# EAGLE design miniUPS (EAGLE 9.6.0)
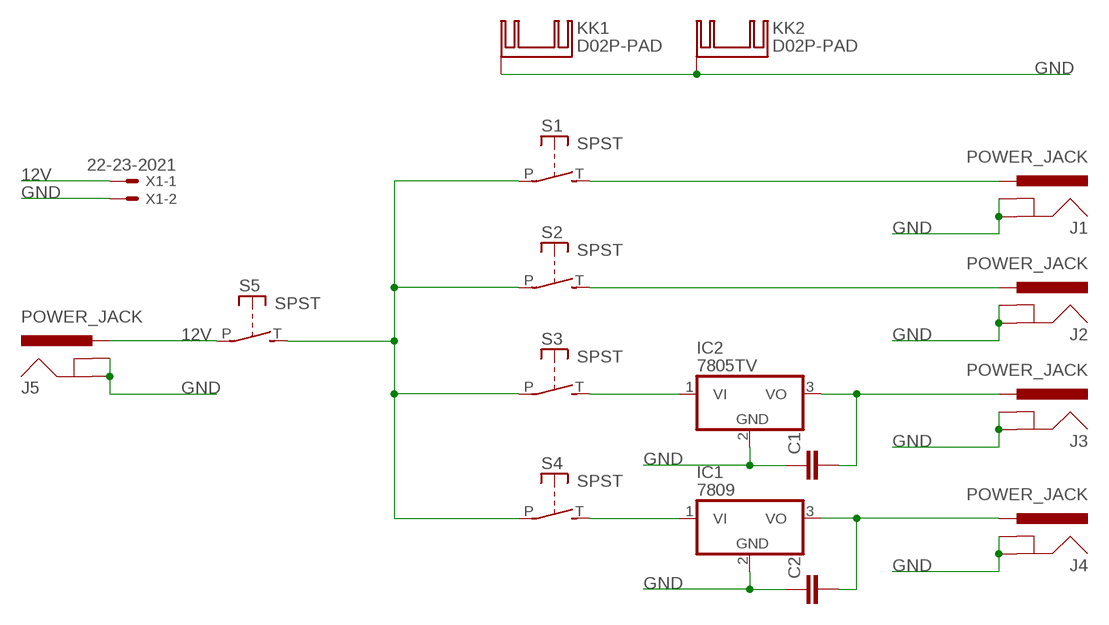
[diagram p0: schematic, sheet 1]

## Parts
C1  CAPPTH2  [CAP-PTH-SMALL2]
C2  CAPPTH2  [CAP-PTH-SMALL2]
IC1  7809  7805TV  [TO220V]
IC2  7805TV  [TO220V]
J1  POWER_JACK  [POWER_JACK_PTH]
J2  POWER_JACK  [POWER_JACK_PTH]
J3  POWER_JACK  [POWER_JACK_PTH]
J4  POWER_JACK  [POWER_JACK_PTH]
J5  POWER_JACK  [POWER_JACK_PTH]
KK1  D02P-PAD  [D02PA-PAD]
KK2  D02P-PAD  [D02PA-PAD]
S1  SPST  [JUDCOSPST]
S2  SPST  [JUDCOSPST]
S3  SPST  [JUDCOSPST]
S4  SPST  [JUDCOSPST]
S5  SPST  [JUDCOSPST]
X1  22-23-2021  [22-23-2021]

## Nets
12V: J5.PWR S5.P X1.1
GND: C1.1 C2.1 IC1.2(GND) IC2.2(GND) J1.GND J1.GNDBREAK J2.GND J2.GNDBREAK J3.GND J3.GNDBREAK J4.GND J4.GNDBREAK J5.GND J5.GNDBREAK KK1.B(K) KK2.B(K) X1.2
N$1: J1.PWR S1.T(S)
N$2: J2.PWR S2.T(S)
N$3: C1.2 IC2.3(VO) J3.PWR
N$4: C2.2 IC1.3(VO) J4.PWR
N$5: IC2.1(VI) S3.T(S)
N$8: IC1.1(VI) S4.T(S)
N$9: S1.P S2.P S3.P S4.P S5.T(S)

## Library data of the parts
C1 C2 = 1X08_OFFSET_75_PERCENT:CAP: Capacitor Standard 0603 ceramic capacitor, and 0.1" leaded capacitor.
IC1 IC2 = linear:78*: Positive VOLTAGE REGULATOR Source: http://cache.national.com/ds/LM/LM78L05.pdf http://www.fairchildsemi.com/ds/LM/LM7805.pdf
J1-J5 = SparkFun-Connectors:POWER_JACK: Power Jack Connector This is the standard 5.5mm barrel jack for power. The PTH is the most common, proven, reliable, footprint. The Slot footprint only works if the mill layer is transmitted to the PCB fab house so be warned. Here are the connectors we sell at SparkFun: DC Barrel Power Jack/Connector <https://www.sparkfun.com/products/119> (PRT-00119) DC Barrel Power Jack/Connector (SMD) <https://www.sparkfun.com/products/12748> (PRT-12748) DC Barrel Jack Adapter - Breadboard Compatible <https://www.sparkfun.com/products/10811> (PRT-10811) It is used on this SparkFun product (and many, many others): SparkFun RedBoard - Programmed with Arduino <https://www.sparkfun.com/products/12757> (DEV-12757) Also, if you need a mating power supply or connector, please check these out: Wall Adapter Power Supply - 9VDC 650mA <https://www.sparkfun.com/products/298> (TOL-00298) DC Barrel Jack Adapter - Male <https://www.sparkfun.com/products/10287> (PRT-10287); PROD_ID: CONN-08197
KK1 KK2 = heatsink:D02P-PAD: HEATSINK distributor Schukat
S1-S5 = adafruit:SPST: Judco 50-0015-00
X1 = con-molex:22-23-2021: .100" (2.54mm) Center Header - 2 Pin; MF: MOLEX; MPN: 22-23-2021; OC_FARNELL: 1462926; OC_NEWARK: 25C3832

## Board
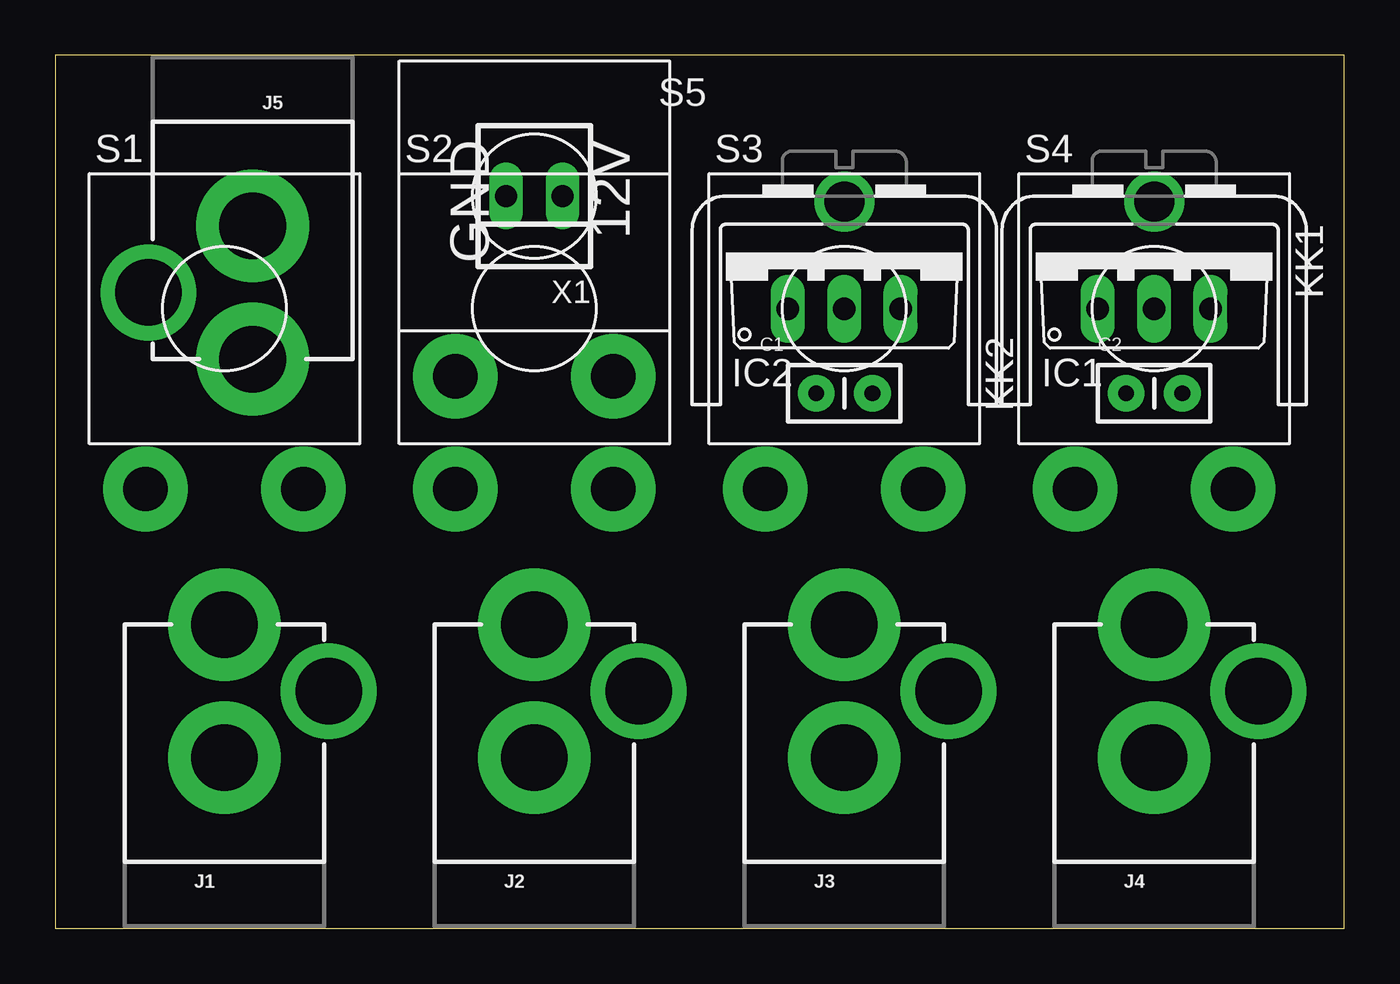
[diagram p1: board, top side]
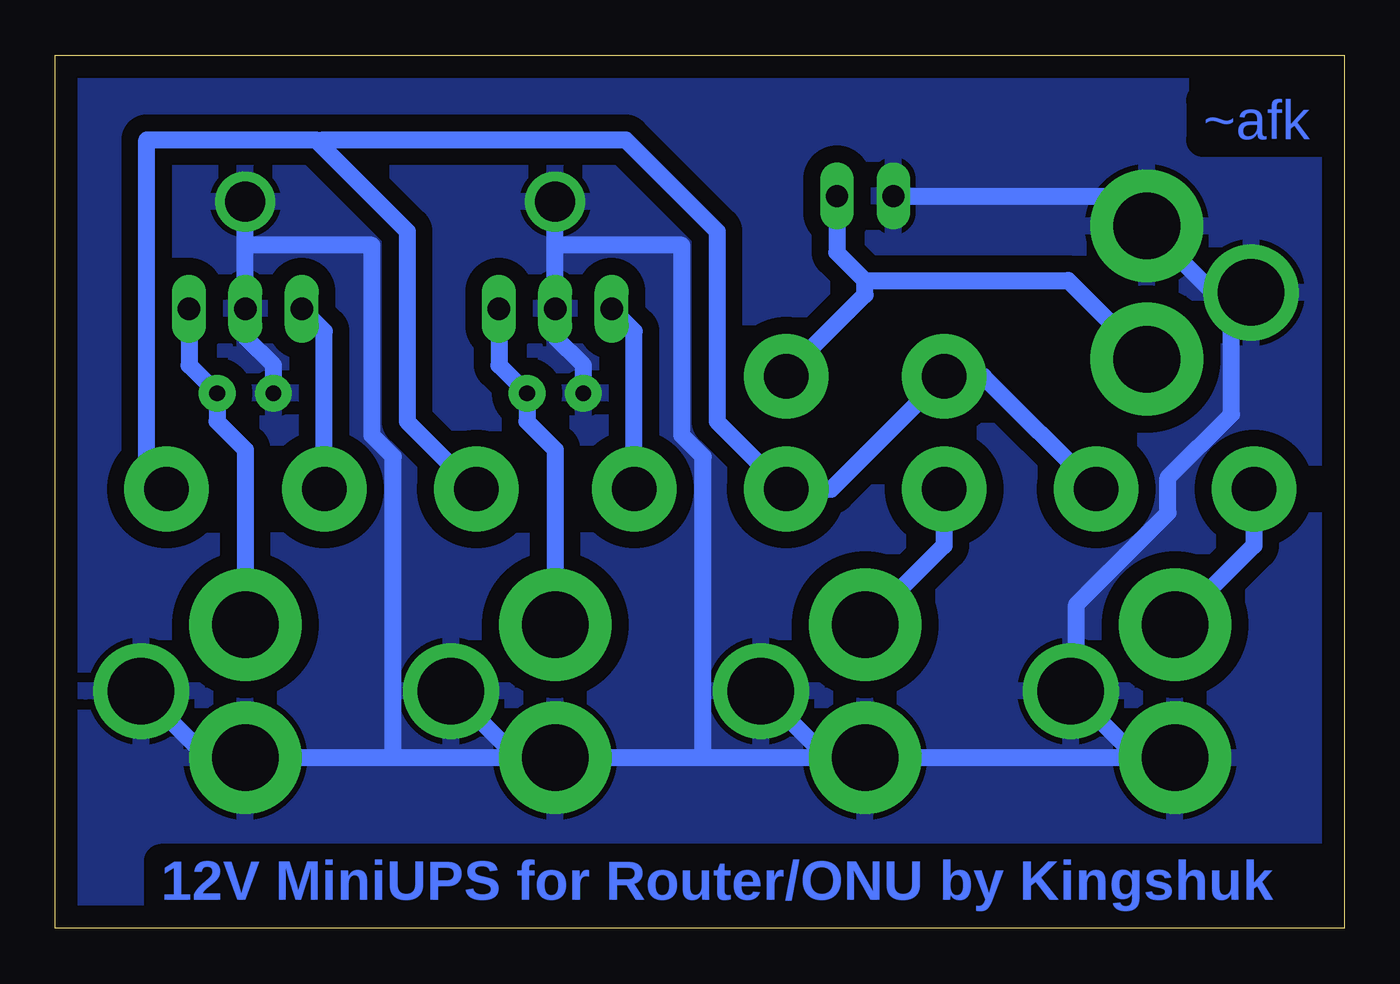
[diagram p2: board, bottom side, seen from below]

Size 58.09 x 39.36 mm. Coordinates in mm from the lower left corner, seen from the top.
Outline: 0,0 58.09,0 58.09,39.36 0,39.36 0,0
Copper layers (1*16): Top 0.035mm / dielectric 1.5mm / Bottom 0.035mm
Design rules "default *": minimum track width 30mil, minimum drill 0.35mm, track to track 30mil, track to pad 30mil, pad to pad 30mil, via to via 30mil, smd to smd 6mil, copper to edge 40mil, drill to drill 30mil, minimum pad ring 10mil, minimum via ring 8mil, stop-mask expansion 4mil, vias tented up to drill 0mil, thermal gap 10mil

### Footprints (pad centres in the part's own frame; a part is rotated, then mirrored left to right if it is on the bottom)
CAP-PTH-SMALL2 = drill 0.7 pad 1.651: 1 0,0; 2 2.54,0
TO220V = drill 1.016 long: 1 -2.54,-2.54; 2 0,-2.54; 3 2.54,-2.54
POWER_JACK_PTH = drill 2.997 pad 5.08: GND 0,7.7; PWR 0,13.7 | drill 2.997 pad 4.318: GNDBREAK 4.7,10.7
D02PA-PAD = drill 1.803 pad 2.54: B 0,-1.016
JUDCOSPST = drill 2 pad 3.81: P 3.556,-8.128; T -3.556,-8.128
22-23-2021 = drill 1 long: 1 -1.27,0; 2 1.27,0

### Placement (x,y rotation side)
C1  34.29,24.13 0 top
C2  48.26,24.13 0 top
IC1  49.53,30.48 0 top
IC2  35.56,30.48 0 top
J1  7.62,0 0 top
J2  21.59,0 0 top
J3  35.56,0 0 top
J4  49.53,0 0 top
J5  8.89,39.37 180 top
KK1  49.53,31.75 180 top
KK2  35.56,31.75 180 top
S1  7.62,27.94 0 top
S2  21.59,27.94 0 top
S3  35.56,27.94 0 top
S4  49.53,27.94 0 top
S5  21.59,33.02 0 top
X1  21.59,33.02 180 top

### Tracks (layer width: path | path; a pad name or v marks a point on that pad's centre or on a via)
12V
  Bottom 0.762: X1.1 22.86,30.48 21.59,29.21 | J5.PWR 12.43,29.21 21.59,29.21 | S5.P 25.08,25.08 21.59,28.57 21.59,29.21
GND
  Bottom 0.762: J2.GND J1.GND 9.32,7.7 J1.GNDBREAK 12.06,10.79 12.06,14.61 7.94,18.73 7.94,20.32 5.08,23.18 5.08,28.57 J5.GNDBREAK 5.89,28.67 J5.GND 10.24,33.02 X1.2 | J2.GND 28.89,7.7 | 28.89,7.7 J3.GND | J3.GND 42.86,7.7 | 42.86,7.7 J4.GND 51.23,7.7 J4.GNDBREAK | J3.GNDBREAK 37.26,7.7 J3.GND | J2.GNDBREAK 23.29,7.7 J2.GND | C1.1 34.29,25.4 35.56,26.67 IC2.2 35.56,30.8 | C2.1 48.26,25.4 49.53,26.67 IC1.2 49.53,30.8 | 35.56,30.8 KK2.B | 49.53,30.8 KK1.B | 35.56,30.8 29.84,30.8 29.84,22.23 28.89,21.27 28.89,7.7 | 49.53,30.8 43.81,30.8 43.81,22.23 42.86,21.27 42.86,7.7
  pour Bottom: 0,40.64 58.42,40.64 59.69,39.37 59.69,1.27 59.69,0 58.42,-1.27 0,-1.27 -1.27,0 -1.27,39.37
N$1
  Bottom 0.762: S1.T 4.06,17.26 J1.PWR
N$2
  Bottom 0.762: S2.T 18.03,17.26 J2.PWR
N$3
  Bottom 0.762: J3.PWR 35.56,21.59 36.83,22.86 C1.2 38.1,25.4 IC2.3
N$4
  Bottom 0.762: J4.PWR 49.53,21.59 50.8,22.86 C2.2 52.07,25.4 IC1.3
N$5
  Bottom 0.762: S3.T 32,26.92 IC2.1
N$8
  Bottom 0.762: S4.T 45.97,26.92 IC1.1
N$9
  Bottom 0.762: S1.P 16.26,24.89 S5.T 23.11,19.81 S2.P 25.4,20 28.26,22.86 28.26,31.43 32.38,35.56 46.04,35.56 46.2,35.4 | 46.2,35.4 46.35,35.56 53.98,35.56 53.98,20.64 53.34,20 S4.P | 46.2,35.4 42.23,31.43 42.23,22.86 39.37,20 S3.P

### Text on the board
Bottom: ~afk | 12V MiniUPS for Router/ONU by Kingshuk
tNames: GND | 12V